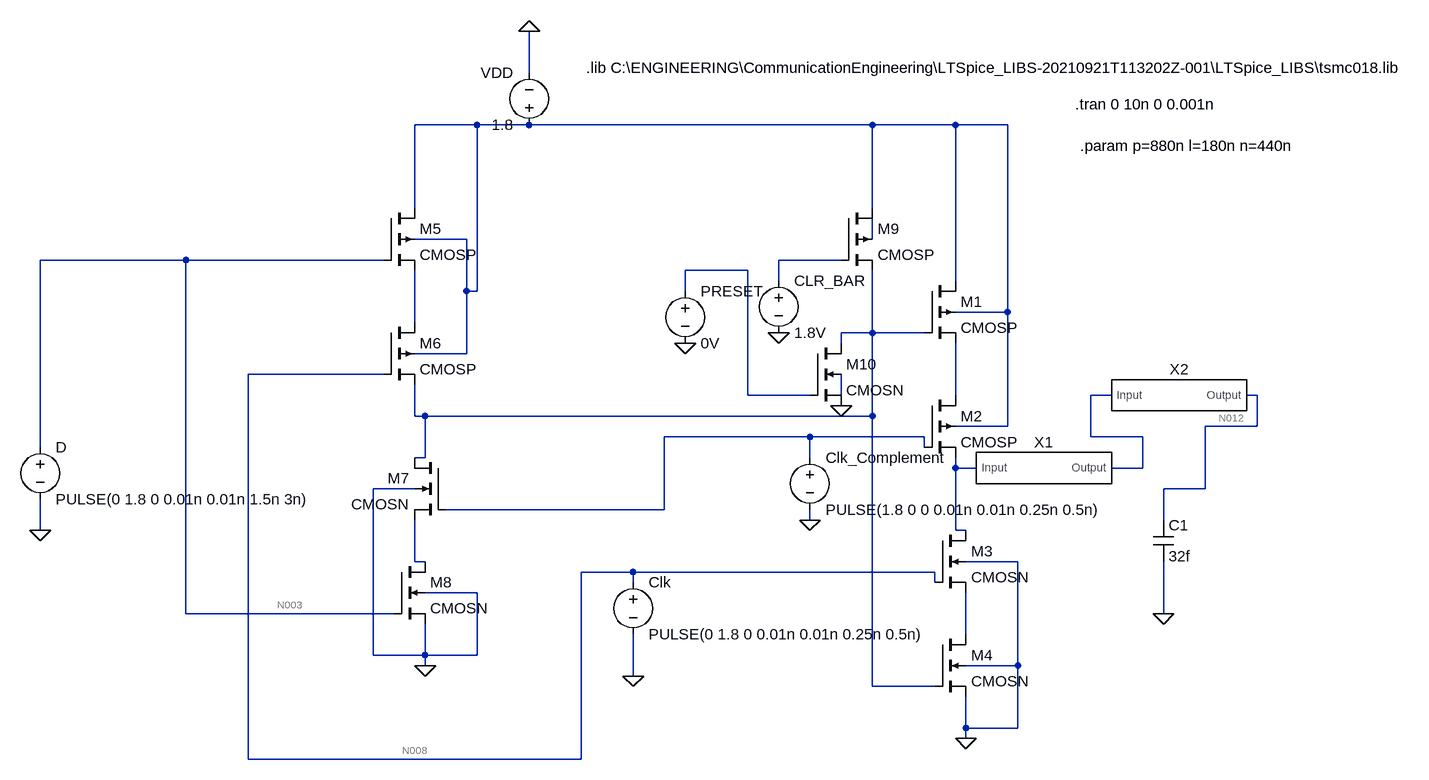
[diagram p0: schematic D_Flip_Flop_exper1.asc]
D_Flip_Flop_exper1.asc, the LTspice schematic file:
Version 4
SHEET 1 1324 1044
WIRE -160 -16 -160 -80
WIRE -240 64 -336 64
WIRE -160 64 -240 64
WIRE 368 64 -160 64
WIRE 496 64 368 64
WIRE 576 64 496 64
WIRE -336 192 -336 64
WIRE 368 192 368 64
WIRE -256 240 -336 240
WIRE 368 240 368 208
WIRE -688 272 -912 272
WIRE -384 272 -688 272
WIRE 320 272 224 272
WIRE 176 288 80 288
WIRE 224 304 224 272
WIRE 496 304 496 64
WIRE -256 320 -256 240
WIRE -240 320 -240 64
WIRE -240 320 -256 320
WIRE 80 320 80 288
WIRE 576 352 576 64
WIRE 576 352 496 352
WIRE -336 368 -336 288
WIRE 368 384 368 288
WIRE 368 384 320 384
WIRE 448 384 368 384
WIRE 320 400 320 384
WIRE -256 416 -256 320
WIRE -256 416 -336 416
WIRE -384 448 -592 448
WIRE 176 480 176 288
WIRE 272 480 176 480
WIRE 320 480 320 448
WIRE 496 480 496 400
WIRE 736 480 704 480
WIRE 960 480 944 480
WIRE -336 512 -336 464
WIRE -320 512 -336 512
WIRE 368 512 368 384
WIRE 368 512 -320 512
WIRE 576 528 576 352
WIRE 576 528 496 528
WIRE 960 528 960 480
WIRE 960 528 880 528
WIRE 272 544 48 544
WIRE 448 544 272 544
WIRE 704 544 704 480
WIRE 784 544 704 544
WIRE -912 560 -912 272
WIRE 448 560 448 544
WIRE -320 576 -320 512
WIRE -320 576 -336 576
WIRE 272 576 272 544
WIRE 496 592 496 576
WIRE 528 592 496 592
WIRE 784 592 784 544
WIRE 784 592 736 592
WIRE -336 624 -400 624
WIRE 880 624 880 528
WIRE 880 624 816 624
WIRE 48 656 48 544
WIRE 48 656 -288 656
WIRE 272 672 272 656
WIRE 816 672 816 624
WIRE -912 688 -912 640
WIRE 496 688 496 592
WIRE 512 688 496 688
WIRE -336 736 -336 672
WIRE -320 736 -336 736
WIRE 592 736 512 736
WIRE 0 752 -80 752
WIRE 464 752 0 752
WIRE 0 768 0 752
WIRE 464 768 464 752
WIRE -240 784 -320 784
WIRE -688 816 -688 272
WIRE -368 816 -688 816
WIRE 816 816 816 736
WIRE 512 848 512 784
WIRE -400 880 -400 624
WIRE -320 880 -320 832
WIRE -320 880 -400 880
WIRE -240 880 -240 784
WIRE -240 880 -320 880
WIRE -320 896 -320 880
WIRE 592 896 592 736
WIRE 592 896 512 896
WIRE 0 912 0 848
WIRE 368 928 368 512
WIRE 464 928 368 928
WIRE 512 992 512 944
WIRE 592 992 592 896
WIRE 592 992 512 992
WIRE 512 1008 512 992
WIRE -592 1040 -592 448
WIRE -80 1040 -80 752
WIRE -80 1040 -592 1040
FLAG -160 -80 0
FLAG 0 912 0
FLAG 512 1008 0
FLAG 816 816 0
FLAG 272 672 0
FLAG -320 896 0
FLAG -912 688 0
FLAG 224 384 0
FLAG 320 496 0
FLAG 80 400 0
SYMBOL pmos4 448 304 R0
SYMATTR InstName M1
SYMATTR Value CMOSP
SYMATTR Value2 l={l} w={p}
SYMBOL pmos4 448 480 R0
SYMATTR InstName M2
SYMATTR Value CMOSP
SYMATTR Value2 l={l} w={p}
SYMBOL nmos4 464 688 R0
SYMATTR InstName M3
SYMATTR Value CMOSN
SYMATTR Value2 l={l} w={n}
SYMBOL nmos4 464 848 R0
SYMATTR InstName M4
SYMATTR Value CMOSN
SYMATTR Value2 l={l} w={n}
SYMBOL voltage -160 80 R180
WINDOW 0 24 96 Left 2
WINDOW 3 24 16 Left 2
SYMATTR InstName VDD
SYMATTR Value 1.8
SYMBOL voltage 0 752 R0
WINDOW 123 0 0 Left 0
WINDOW 39 0 0 Left 0
SYMATTR InstName Clk
SYMATTR Value PULSE(0 1.8 0 0.01n 0.01n 0.25n 0.5n)
SYMBOL cap 800 672 R0
SYMATTR InstName C1
SYMATTR Value 32f
SYMBOL voltage 272 560 R0
WINDOW 123 0 0 Left 0
WINDOW 39 0 0 Left 0
SYMATTR InstName Clk_Complement
SYMATTR Value PULSE(1.8 0 0 0.01n 0.01n 0.25n 0.5n)
SYMBOL pmos4 -384 192 R0
SYMATTR InstName M5
SYMATTR Value CMOSP
SYMATTR Value2 l={l} w={p}
SYMBOL pmos4 -384 368 R0
SYMATTR InstName M6
SYMATTR Value CMOSP
SYMATTR Value2 l={l} w={p}
SYMBOL nmos4 -288 576 M0
SYMATTR InstName M7
SYMATTR Value CMOSN
SYMATTR Value2 l={l} w={n}
SYMBOL nmos4 -368 736 R0
SYMATTR InstName M8
SYMATTR Value CMOSN
SYMATTR Value2 l={l} w={n}
SYMBOL voltage -912 544 R0
WINDOW 123 0 0 Left 0
WINDOW 39 0 0 Left 0
SYMATTR InstName D
SYMATTR Value PULSE(0 1.8 0 0.01n 0.01n 1.5n 3n)
SYMBOL pmos4 320 192 R0
SYMATTR InstName M9
SYMATTR Value CMOSP
SYMATTR Value2 l={l} w={p}
SYMBOL voltage 224 288 R0
WINDOW 123 0 0 Left 0
WINDOW 39 0 0 Left 0
SYMATTR InstName CLR_BAR
SYMATTR Value 1.8V
SYMBOL nmos4 272 400 R0
SYMATTR InstName M10
SYMATTR Value CMOSN
SYMATTR Value2 l={l} w={n}
SYMBOL voltage 80 304 R0
WINDOW 123 0 0 Left 0
WINDOW 39 0 0 Left 0
SYMATTR InstName PRESET
SYMATTR Value 0V
SYMBOL NOT_model1 624 592 R0
SYMATTR InstName X1
SYMBOL NOT_model1 832 480 R0
SYMATTR InstName X2
TEXT -72 -24 Left 2 !.lib C:\\ENGINEERING\\CommunicationEngineering\\LTSpice_LIBS-20210921T113202Z-001\\LTSpice_LIBS\\tsmc018.lib
TEXT 680 32 Left 2 !.tran 0 10n 0 0.001n
TEXT 688 96 Left 2 !.param p=880n l=180n n=440n

The netlist it stands for:
* D_Flip_Flop_exper1.asc
M1 N001 N007 N010 N001 CMOSP l={l} w={p}
M2 N010 N013 N014 N001 CMOSP l={l} w={p}
M3 N014 N008 N016 0 CMOSN l={l} w={n}
M4 N016 N007 0 0 CMOSN l={l} w={n}
VDD N001 0 1.8
V§Clk N008 0 PULSE(0 1.8 0 0.01n 0.01n 0.25n 0.5n)
C1 N012 0 32f
V§Clk_Complement N013 0 PULSE(1.8 0 0 0.01n 0.01n 0.25n 0.5n)
M5 N001 N003 N006 N001 CMOSP l={l} w={p}
M6 N006 N008 N007 N001 CMOSP l={l} w={p}
M7 N007 N013 N015 0 CMOSN l={l} w={n}
M8 N015 N003 0 0 CMOSN l={l} w={n}
V§D N003 0 PULSE(0 1.8 0 0.01n 0.01n 1.5n 3n)
M9 N001 N004 N007 N002 CMOSP l={l} w={p}
V§CLR_BAR N004 0 1.8V
M10 N007 N005 0 N009 CMOSN l={l} w={n}
V§PRESET N005 0 0V
XX1 N014 N011 NOT0  ; pins Input Output
XX2 N011 N012 NOT0  ; pins Input Output
.model NMOS NMOS
.model PMOS PMOS
.lib standard.mos
.lib C:\ENGINEERING\CommunicationEngineering\LTSpice_LIBS-20210921T113202Z-001\LTSpice_LIBS\tsmc018.lib
.tran 0 10n 0 0.001n
.param p=880n l=180n n=440n
.backanno
.end

* Results of the author's LTspice run, read from the files saved beside the schematic
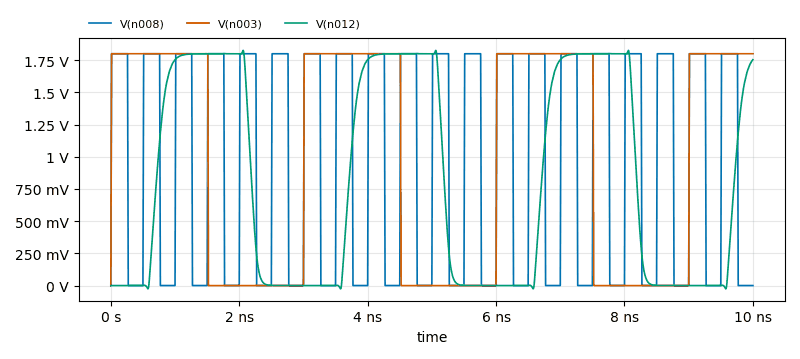
[diagram p1: Transient Analysis of D_Flip_Flop_exper1.asc, plotted from the saved traces]
* Transient Analysis, 1 run:
*   V(n008): min 0 V, max 1.8 V, average 936 mV, rms 1.29 V, last 0 V
*   V(n003): min 0 V, max 1.8 V, average 994.5 mV, rms 1.337 V, last 1.8 V
*   V(n012): min -25.33 mV, max 1.826 V, average 827.1 mV, rms 1.172 V, last 1.754 V